# Altium schematic sheet RTM_SFP_TOP.SchDoc: RTM SFP TOP
size 420 x 297 mm; SheetNumber: 5; SheetTotal: 8
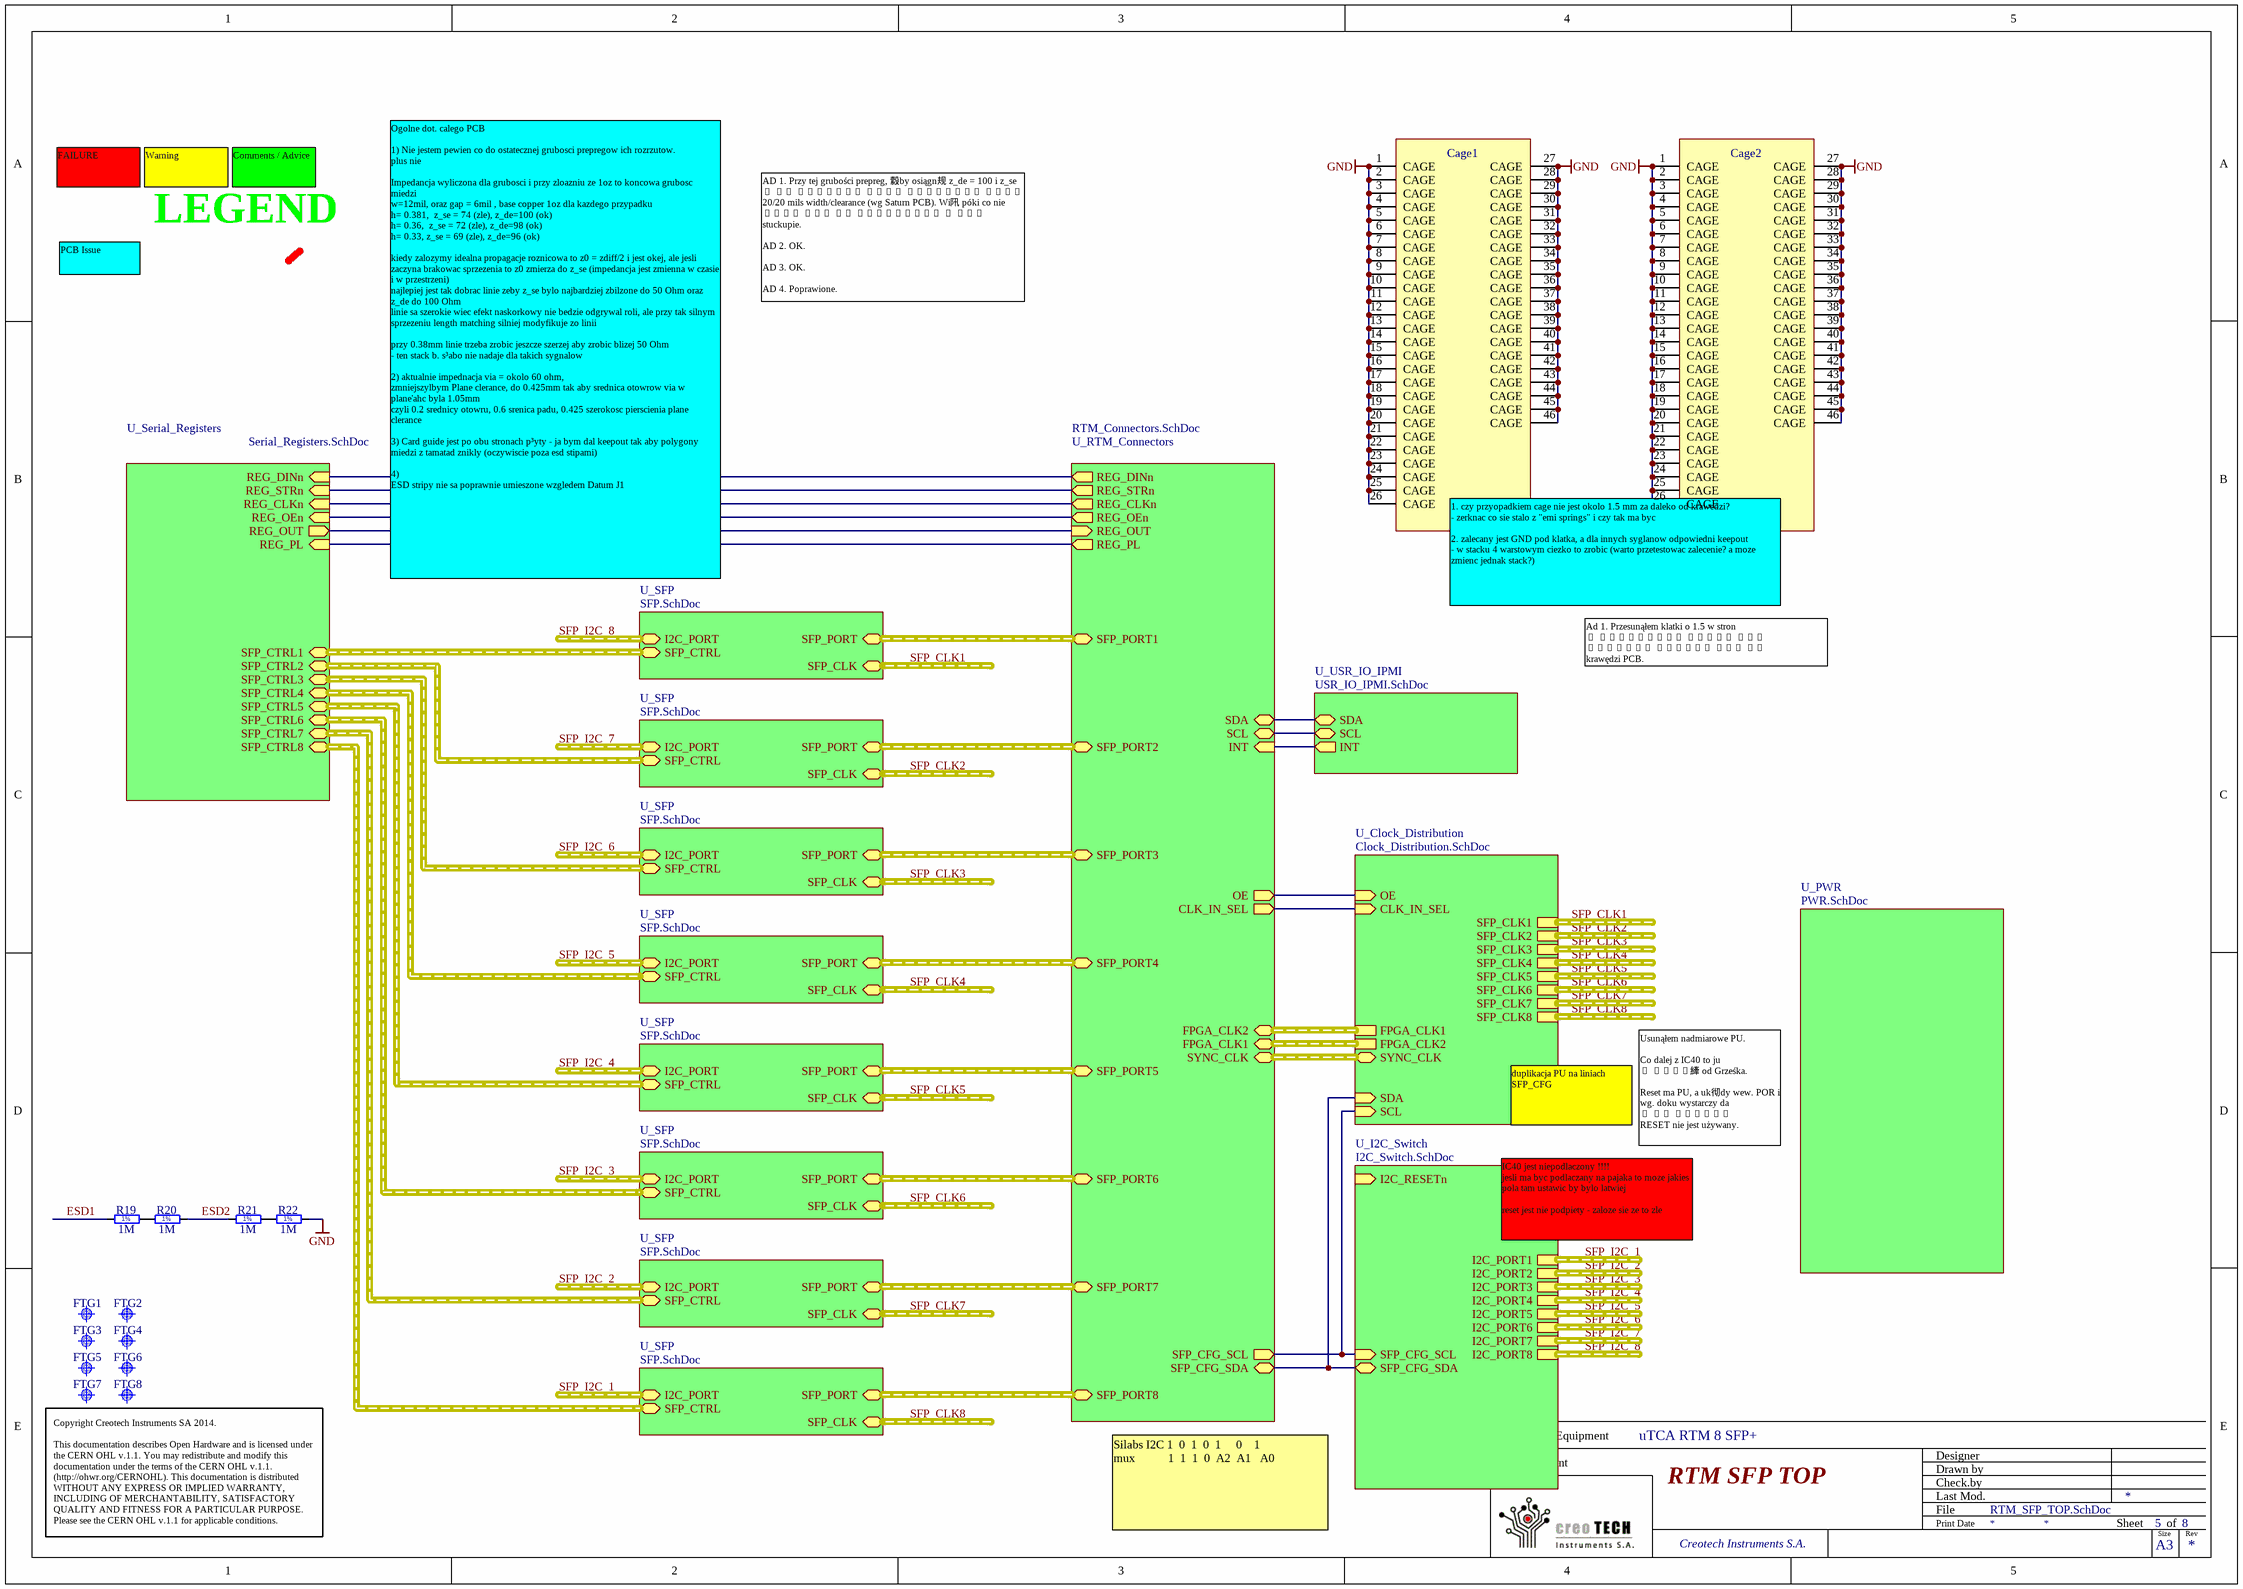
[diagram p0: RTM_SFP_TOP.SchDoc]

## Parts
Cage1  SFP+  [TYCO_2007132-1]
Cage2  SFP+  [TYCO_2007132-1]
FTG1  Use only in PCB  [FIDUCIAL_TOP_S100-200]  (value not drawn)
FTG2  Use only in PCB  [FIDUCIAL_TOP_C100-200]  (value not drawn)
FTG3  Use only in PCB  [FIDUCIAL_TOP_S100-200]  (value not drawn)
FTG4  Use only in PCB  [FIDUCIAL_TOP_C100-200]  (value not drawn)
FTG5  Use only in PCB  [FIDUCIAL_TOP_S100-200]  (value not drawn)
FTG6  Use only in PCB  [FIDUCIAL_TOP_C100-200]  (value not drawn)
FTG7  Use only in PCB  [FIDUCIAL_TOP_S100-200]  (value not drawn)
FTG8  Use only in PCB  [FIDUCIAL_TOP_C100-200]  (value not drawn)
R19  1M  [RESC3216X65N]
R20  1M  [RESC3216X65N]
R21  1M  [RESC3216X65N]
R22  1M  [RESC3216X65N]

## Sub-sheets
U_Clock_Distribution = Clock_Distribution.SchDoc: SDA (in), SCL (in), OE (in), CLK_IN_SEL (in), FPGA_CLK1 (harness CLOCK_DIFF), FPGA_CLK2 (harness CLOCK_DIFF), SFP_CLK2 (harness CLOCK_DIFF), SFP_CLK3 (harness CLOCK_DIFF), SFP_CLK4 (harness CLOCK_DIFF), SFP_CLK5 (harness CLOCK_DIFF), SFP_CLK6 (harness CLOCK_DIFF), SFP_CLK7 (harness CLOCK_DIFF), SFP_CLK8 (harness CLOCK_DIFF), SFP_CLK1 (harness CLOCK_DIFF), SYNC_CLK (harness CLOCK_DIFF)
U_I2C_Switch = I2C_Switch.SchDoc: I2C_RESETn (in), I2C_PORT5 (harness I2C), I2C_PORT2 (harness I2C), I2C_PORT1 (harness I2C), I2C_PORT4 (harness I2C), I2C_PORT3 (harness I2C), I2C_PORT7 (harness I2C), I2C_PORT6 (harness I2C), I2C_PORT8 (harness I2C), SFP_CFG_SDA (bidir), SFP_CFG_SCL (in)
U_PWR = PWR.SchDoc: no entries
U_RTM_Connectors = RTM_Connectors.SchDoc: SFP_PORT8 (harness SFP_PORT), SFP_PORT7 (harness SFP_PORT), SFP_PORT6 (harness SFP_PORT), SFP_PORT5 (harness SFP_PORT), SFP_PORT4 (harness SFP_PORT), SFP_PORT3 (harness SFP_PORT), SFP_PORT2 (harness SFP_PORT), SFP_PORT1 (harness SFP_PORT), REG_DINn (out), REG_STRn (out), REG_CLKn (out), REG_OEn (out), REG_OUT (in), SFP_CFG_SDA (bidir), SFP_CFG_SCL (out), SDA (bidir), SCL (bidir), INT (in), FPGA_CLK2 (harness CLOCK_DIFF), FPGA_CLK1 (harness CLOCK_DIFF), SYNC_CLK (harness CLOCK_DIFF), OE (out), CLK_IN_SEL (out), REG_PL (out)
U_Serial_Registers = Serial_Registers.SchDoc: SFP_CTRL1 (harness SFP_CTRL), SFP_CTRL2 (harness SFP_CTRL), SFP_CTRL3 (harness SFP_CTRL), SFP_CTRL4 (harness SFP_CTRL), SFP_CTRL5 (harness SFP_CTRL), SFP_CTRL6 (harness SFP_CTRL), SFP_CTRL7 (harness SFP_CTRL), SFP_CTRL8 (harness SFP_CTRL), REG_DINn (in), REG_STRn (in), REG_CLKn (in), REG_OEn (in), REG_OUT (out), REG_PL (in)
U_SFP = SFP.SchDoc: I2C_PORT (harness I2C), SFP_CLK (harness CLOCK_DIFF), SFP_PORT (harness SFP_PORT), SFP_CTRL (harness SFP_CTRL)
U_SFP = SFP.SchDoc: I2C_PORT (harness I2C), SFP_CLK (harness CLOCK_DIFF), SFP_PORT (harness SFP_PORT), SFP_CTRL (harness SFP_CTRL)
U_SFP = SFP.SchDoc: I2C_PORT (harness I2C), SFP_CLK (harness CLOCK_DIFF), SFP_PORT (harness SFP_PORT), SFP_CTRL (harness SFP_CTRL)
U_SFP = SFP.SchDoc: I2C_PORT (harness I2C), SFP_CLK (harness CLOCK_DIFF), SFP_PORT (harness SFP_PORT), SFP_CTRL (harness SFP_CTRL)
U_SFP = SFP.SchDoc: I2C_PORT (harness I2C), SFP_CLK (harness CLOCK_DIFF), SFP_PORT (harness SFP_PORT), SFP_CTRL (harness SFP_CTRL)
U_SFP = SFP.SchDoc: I2C_PORT (harness I2C), SFP_CLK (harness CLOCK_DIFF), SFP_PORT (harness SFP_PORT), SFP_CTRL (harness SFP_CTRL)
U_SFP = SFP.SchDoc: I2C_PORT (harness I2C), SFP_CLK (harness CLOCK_DIFF), SFP_PORT (harness SFP_PORT), SFP_CTRL (harness SFP_CTRL)
U_SFP = SFP.SchDoc: I2C_PORT (harness I2C), SFP_CLK (harness CLOCK_DIFF), SFP_PORT (harness SFP_PORT), SFP_CTRL (harness SFP_CTRL)
U_USR_IO_IPMI = USR_IO_IPMI.SchDoc: SDA (bidir), SCL (bidir), INT (out)

## Nets
GND: Cage1.1(CAGE) Cage1.2(CAGE) Cage1.3(CAGE) Cage1.4(CAGE) Cage1.5(CAGE) Cage1.6(CAGE) Cage1.7(CAGE) Cage1.8(CAGE) Cage1.9(CAGE) Cage1.10(CAGE) Cage1.11(CAGE) Cage1.12(CAGE) Cage1.13(CAGE) Cage1.14(CAGE) Cage1.15(CAGE) Cage1.16(CAGE) Cage1.17(CAGE) Cage1.18(CAGE) Cage1.19(CAGE) Cage1.20(CAGE) Cage1.21(CAGE) Cage1.22(CAGE) Cage1.23(CAGE) Cage1.24(CAGE) Cage1.25(CAGE) Cage1.26(CAGE) Cage1.27(CAGE) Cage1.28(CAGE) Cage1.29(CAGE) Cage1.30(CAGE) Cage1.31(CAGE) Cage1.32(CAGE) Cage1.33(CAGE) Cage1.34(CAGE) Cage1.35(CAGE) Cage1.36(CAGE) Cage1.37(CAGE) Cage1.38(CAGE) Cage1.39(CAGE) Cage1.40(CAGE) Cage1.41(CAGE) Cage1.42(CAGE) Cage1.43(CAGE) Cage1.44(CAGE) Cage1.45(CAGE) Cage1.46(CAGE) Cage2.1(CAGE) Cage2.2(CAGE) Cage2.3(CAGE) Cage2.4(CAGE) Cage2.5(CAGE) Cage2.6(CAGE) Cage2.7(CAGE) Cage2.8(CAGE) Cage2.9(CAGE) Cage2.10(CAGE) Cage2.11(CAGE) Cage2.12(CAGE) Cage2.13(CAGE) Cage2.14(CAGE) Cage2.15(CAGE) Cage2.16(CAGE) Cage2.17(CAGE) Cage2.18(CAGE) Cage2.19(CAGE) Cage2.20(CAGE) Cage2.21(CAGE) Cage2.22(CAGE) Cage2.23(CAGE) Cage2.24(CAGE) Cage2.25(CAGE) Cage2.26(CAGE) Cage2.27(CAGE) Cage2.28(CAGE) Cage2.29(CAGE) Cage2.30(CAGE) Cage2.31(CAGE) Cage2.32(CAGE) Cage2.33(CAGE) Cage2.34(CAGE) Cage2.35(CAGE) Cage2.36(CAGE) Cage2.37(CAGE) Cage2.38(CAGE) Cage2.39(CAGE) Cage2.40(CAGE) Cage2.41(CAGE) Cage2.42(CAGE) Cage2.43(CAGE) Cage2.44(CAGE) Cage2.45(CAGE) Cage2.46(CAGE) R22.2
ESD1: R19.1
ESD2: R20.2 R21.1
NetR19_2: R19.2 R20.1
NetR21_2: R21.2 R22.1
(unnamed): sheet U_I2C_Switch/SFP_CFG_SDA, sheet U_Clock_Distribution/SDA, sheet U_RTM_Connectors/SFP_CFG_SDA
(unnamed): sheet U_I2C_Switch/SFP_CFG_SCL, sheet U_Clock_Distribution/SCL, sheet U_RTM_Connectors/SFP_CFG_SCL
(unnamed): sheet U_Clock_Distribution/OE, sheet U_RTM_Connectors/OE
(unnamed): sheet U_Clock_Distribution/CLK_IN_SEL, sheet U_RTM_Connectors/CLK_IN_SEL
(unnamed): sheet U_Serial_Registers/REG_DINn, sheet U_RTM_Connectors/REG_DINn
(unnamed): sheet U_Serial_Registers/REG_STRn, sheet U_RTM_Connectors/REG_STRn
(unnamed): sheet U_Serial_Registers/REG_CLKn, sheet U_RTM_Connectors/REG_CLKn
(unnamed): sheet U_Serial_Registers/REG_OEn, sheet U_RTM_Connectors/REG_OEn
(unnamed): sheet U_Serial_Registers/REG_OUT, sheet U_RTM_Connectors/REG_OUT
(unnamed): sheet U_Serial_Registers/REG_PL, sheet U_RTM_Connectors/REG_PL
(unnamed): sheet U_RTM_Connectors/SDA, sheet U_USR_IO_IPMI/SDA
(unnamed): sheet U_RTM_Connectors/SCL, sheet U_USR_IO_IPMI/SCL
(unnamed): sheet U_RTM_Connectors/INT, sheet U_USR_IO_IPMI/INT

## Buses and harness runs
harness SFP_CLK1 = sheet U_Clock_Distribution/SFP_CLK1
harness SFP_CLK1 = sheet U_SFP/SFP_CLK
harness SFP_CLK2 = sheet U_Clock_Distribution/SFP_CLK2
harness SFP_CLK2 = sheet U_SFP/SFP_CLK
harness SFP_CLK3 = sheet U_Clock_Distribution/SFP_CLK3
harness SFP_CLK3 = sheet U_SFP/SFP_CLK
harness SFP_CLK4 = sheet U_Clock_Distribution/SFP_CLK4
harness SFP_CLK4 = sheet U_SFP/SFP_CLK
harness SFP_CLK5 = sheet U_Clock_Distribution/SFP_CLK5
harness SFP_CLK5 = sheet U_SFP/SFP_CLK
harness SFP_CLK6 = sheet U_Clock_Distribution/SFP_CLK6
harness SFP_CLK6 = sheet U_SFP/SFP_CLK
harness SFP_CLK7 = sheet U_Clock_Distribution/SFP_CLK7
harness SFP_CLK7 = sheet U_SFP/SFP_CLK
harness SFP_CLK8 = sheet U_Clock_Distribution/SFP_CLK8
harness SFP_CLK8 = sheet U_SFP/SFP_CLK
harness SFP_I2C_1 = sheet U_I2C_Switch/I2C_PORT1
harness SFP_I2C_1 = sheet U_SFP/I2C_PORT
harness SFP_I2C_2 = sheet U_I2C_Switch/I2C_PORT2
harness SFP_I2C_2 = sheet U_SFP/I2C_PORT
harness SFP_I2C_3 = sheet U_I2C_Switch/I2C_PORT3
harness SFP_I2C_3 = sheet U_SFP/I2C_PORT
harness SFP_I2C_4 = sheet U_I2C_Switch/I2C_PORT4
harness SFP_I2C_4 = sheet U_SFP/I2C_PORT
harness SFP_I2C_5 = sheet U_I2C_Switch/I2C_PORT5
harness SFP_I2C_5 = sheet U_SFP/I2C_PORT
harness SFP_I2C_6 = sheet U_I2C_Switch/I2C_PORT6
harness SFP_I2C_6 = sheet U_SFP/I2C_PORT
harness SFP_I2C_7 = sheet U_I2C_Switch/I2C_PORT7
harness SFP_I2C_7 = sheet U_SFP/I2C_PORT
harness SFP_I2C_8 = sheet U_I2C_Switch/I2C_PORT8
harness SFP_I2C_8 = sheet U_SFP/I2C_PORT
harness sheet U_Clock_Distribution/FPGA_CLK1 = sheet U_RTM_Connectors/FPGA_CLK2
harness sheet U_Clock_Distribution/FPGA_CLK2 = sheet U_RTM_Connectors/FPGA_CLK1
harness sheet U_Clock_Distribution/SYNC_CLK = sheet U_RTM_Connectors/SYNC_CLK
harness sheet U_RTM_Connectors/SFP_PORT1 = sheet U_SFP/SFP_PORT
harness sheet U_RTM_Connectors/SFP_PORT2 = sheet U_SFP/SFP_PORT
harness sheet U_RTM_Connectors/SFP_PORT3 = sheet U_SFP/SFP_PORT
harness sheet U_RTM_Connectors/SFP_PORT4 = sheet U_SFP/SFP_PORT
harness sheet U_RTM_Connectors/SFP_PORT5 = sheet U_SFP/SFP_PORT
harness sheet U_RTM_Connectors/SFP_PORT6 = sheet U_SFP/SFP_PORT
harness sheet U_RTM_Connectors/SFP_PORT7 = sheet U_SFP/SFP_PORT
harness sheet U_RTM_Connectors/SFP_PORT8 = sheet U_SFP/SFP_PORT
harness sheet U_Serial_Registers/SFP_CTRL1 = sheet U_SFP/SFP_CTRL
harness sheet U_Serial_Registers/SFP_CTRL2 = sheet U_SFP/SFP_CTRL
harness sheet U_Serial_Registers/SFP_CTRL3 = sheet U_SFP/SFP_CTRL
harness sheet U_Serial_Registers/SFP_CTRL4 = sheet U_SFP/SFP_CTRL
harness sheet U_Serial_Registers/SFP_CTRL5 = sheet U_SFP/SFP_CTRL
harness sheet U_Serial_Registers/SFP_CTRL6 = sheet U_SFP/SFP_CTRL
harness sheet U_Serial_Registers/SFP_CTRL7 = sheet U_SFP/SFP_CTRL
harness sheet U_Serial_Registers/SFP_CTRL8 = sheet U_SFP/SFP_CTRL

## Notes on the sheet
- FAILURE
- Warning
- Comments / Advice
- PCB Issue
- AD 1. Przy tej grubości prepreg, 縠by osi筭n规 z_de = 100 i z_se = 50 routing diff musiałby mie� 20/20 mils width/clearance (wg Saturn PCB). Wi阠 póki co nie wiem jak to rozwi箊a� w tym stuckupie.
  AD 2. OK.
  AD 3. OK.
  AD 4. Poprawione.
- Ogolne dot. calego PCB
  1) Nie jestem pewien co do ostatecznej grubosci prepregow ich rozrzutow.
  plus nie
  Impedancja wyliczona dla grubosci i przy zloazniu ze 1oz to koncowa grubosc miedzi
  w=12mil, oraz gap = 6mil , base copper 1oz dla kazdego przypadku
  h= 0.381,  z_se = 74 (zle), z_de=100 (ok)
  h= 0.36,  z_se = 72 (zle), z_de=98 (ok)
  h= 0.33, z_se = 69 (zle), z_de=96 (ok)
  kiedy zalozymy idealna propagacje roznicowa to z0 = zdiff/2 i jest okej, ale jesli zaczyna brakowac sprzezenia to z0 zmierza do z_se (impedancja jest zmienna w czasie i w przestrzeni)
  najlepiej jest tak dobrac linie zeby z_se bylo najbardziej zbilzone do 50 Ohm oraz z_de do 100 Ohm
  linie sa szerokie wiec efekt naskorkowy nie bedzie odgrywal roli, ale przy tak silnym sprzezeniu length matching silniej modyfikuje zo linii
  przy 0.38mm linie trzeba zrobic jeszcze szerzej aby zrobic blizej 50 Ohm
  - ten stack b. s³abo nie nadaje dla takich sygnalow
  2) aktualnie impednacja via = okolo 60 ohm,
  zmniejszylbym Plane clerance, do 0.425mm tak aby srednica otowrow via w plane'ahc byla 1.05mm
  czyli 0.2 srednicy otowru, 0.6 srenica padu, 0.425 szerokosc pierscienia plane clerance
  3) Card guide jest po obu stronach p³yty - ja bym dal keepout tak aby polygony miedzi z tamatad znikly (oczywiscie poza esd stipami)
  4)
  ESD stripy nie sa poprawnie umieszone wzgledem Datum J1
- 1. czy przyopadkiem cage nie jest okolo 1.5 mm za daleko od krawedzi?
  - zerknac co sie stalo z "emi springs" i czy tak ma byc
  2. zalecany jest GND pod klatka, a dla innych syglanow odpowiedni keepout
  - w stacku 4 warstowym ciezko to zrobic (warto przetestowac zalecenie? a moze zmienc jednak stack?)
- Ad 1. Przesunąłem klatki o 1.5 w stron� krawędzi. Teraz emi springs ko馽z� si� na krawędzi PCB.
- duplikacja PU na liniach SFP_CFG
- Usunąłem nadmiarowe PU.
  Co dalej z IC40 to ju� zale縴 od Grześka.
  Reset ma PU, a uk彻dy wew. POR i wg. doku wystarczy da� PU jeżeli RESET nie jest używany.
- IC40 jest niepodlaczony !!!!
  jesli ma byc podlaczany na pajaka to moze jakies pola tam ustawic by bylo latwiej
  reset jest nie podpiety - zaloze sie ze to zle
- Silabs I2C 1  0  1  0  1     0    1
  mux           1  1  1  0  A2  A1   A0
- Labels drawn without touching a wire or pin: LEGEND
- Project/Equipment
- Document
- uTCA RTM 8 SFP+
- Designer
- Drawn by
- Check.by
- Copyright Creotech Instruments SA 2014.
  This documentation describes Open Hardware and is licensed under the CERN OHL v.1.1. You may redistribute and modify this documentation under the terms of the CERN OHL v.1.1. (http://ohwr.org/CERNOHL). This documentation is distributed WITHOUT ANY EXPRESS OR IMPLIED WARRANTY, INCLUDING OF MERCHANTABILITY, SATISFACTORY QUALITY AND FITNESS FOR A PARTICULAR PURPOSE. Please see the CERN OHL v.1.1 for applicable conditions.
- Creotech Instruments S.A.
- File
- Last Mod.
- Print Date
- Sheet
- Size
- A3
- of
- Rev
- (in symbol R1206_1M_1%_0.25W_100PPM) 1%

## Library data of the parts
Cage1 Cage2 = TYCO_2007132-1: SFP+  1x4 Cage (46 Pins); Part Description: 1x4 Press Fit Cage For Use with SFP+ Connector (Small Form-factor Pluggable); Manufacturer: TYCO ELECTRONICS; Table: TYCO; Part Number: TYCO_2007132-1; Component Kind: Standard; Component Type: Standard; Pin Count: 46; Family: SFP+; Mounted: Yes; Socket: No; SMD: No; Status: None; Manufacturer Part Number: 2007132-1; ComponentHeight: 9.7mm; HelpURL: \\cern.ch\dfs\Applications\Altium\Datasheets\TYCO_2007132-1.pdf; Author: CERN DEM JLC; CreateDate: 2013-06-04; LatestRevisionDate: 2013-06-12
FTG1 FTG3 FTG5 FTG7 = FIDUCIAL_TARGET_S100-200: Fiducial Target; Part Description: Square Fiducial Target, Top Layer, 1.0mm, Top Solder 2.0mm, Keepout =2.0mm; Mounted: No; Table: Pads; Part Number: FIDUCIAL_TARGET_S100-200; Component Kind: Standard (No BOM); Component Type: Standard (No BOM); Pin Count: 1; Family: Fiducial; Socket: No; SMD: Yes; Status: None; ComponentHeight: 0mm; Author: CERN DEM JLC; CreateDate: 2010-02-09; LatestRevisionDate: 2012-04-04; PackageDescription: Square Fiducial Target, Top Layer, 1.0mm, Top Solder 2.0mm, Keepout =2.0mm
FTG2 FTG4 FTG6 FTG8 = FIDUCIAL_TARGET_C100-200: Fiducial Target; Part Description: Round Fiducial Target, Top Layer, 1.0mm, Top Solder 2.0mm, Keepout =2.0mm; Mounted: No; Table: Pads; Part Number: FIDUCIAL_TARGET_C100-200; Component Kind: Standard (No BOM); Component Type: Standard (No BOM); Pin Count: 1; Family: Fiducial; Socket: No; SMD: Yes; Status: None; ComponentHeight: 0mm; Author: CERN DEM JLC; CreateDate: 2010-02-09; LatestRevisionDate: 2012-04-04; PackageDescription: Round Fiducial Target, Top Layer, 1.0mm, Top Solder 2.0mm, Keepout =2.0mm
R19-R22 = R1206_1M_1%_0.25W_100PPM: Resistor - 1%; Part Description: General Purpose Thick Film Chip Resistor; Manufacturer: GENERIC; Manufacturer1 Part Number: NRC12F1004TRF; Power: 0.25W; TC: ±100ppm/°C; Table: Resistors SMD; Part Number: R1206_1M_1%_0.25W_100PPM; Component Kind: Standard; Component Type: Standard; Pin Count: 2; Value: 1M; Status: Preferred; Tolerance: ±1%; Manufacturer Part Number: R1206_1M_1%_0.25W_100PPM; Case: 1206; Mounted: Yes; Socket: No; SMD: Yes; Manufacturer1 Example: NIC COMPONENT; Manufacturer1 ComponentHeight: 0.65mm; HelpURL: \\cern.ch\dfs\Applications\Altium\Datasheets\R1206_NIC_NRC.pdf; Author: CERN DEM JLC; CreateDate: 2007-12-03; LatestRevisionDate: 2008-03-13